# Altium schematic sheet esquematico.SchDoc
size A4
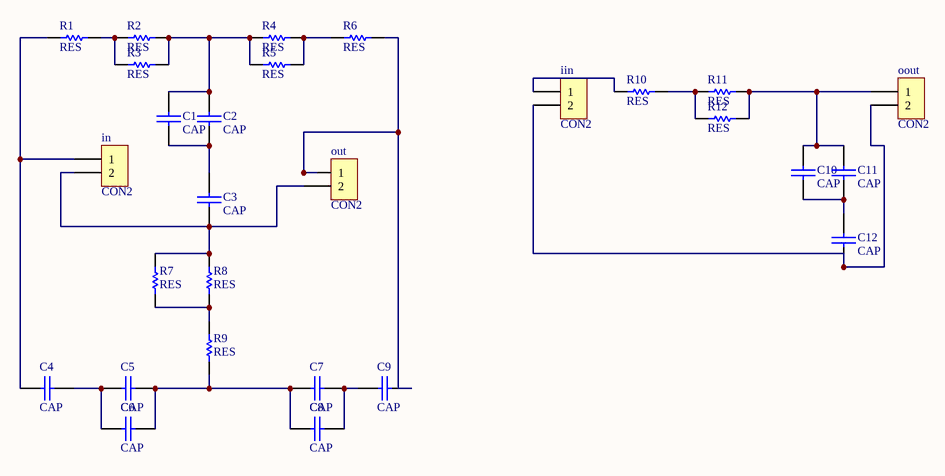
[diagram p0: esquematico.SchDoc]

## Parts
C1  CAP  [CAP200]
C2  CAP  [CAP200]
C3  CAP  [CAP200]
C4  CAP  [CAP200]
C5  CAP  [CAP200]
C6  CAP  [CAP200]
C7  CAP  [CAP200]
C8  CAP  [CAP200]
C9  CAP  [CAP200]
C10  CAP  [CAP200]
C11  CAP  [CAP200]
C12  CAP  [CAP200]
iin  CON2  [SIP2]
in  CON2  [SIP2]
oout  CON2  [SIP2]
out  CON2  [SIP2]
R1  RES  [RES400]
R2  RES  [RES400]
R3  RES  [RES400]
R4  RES  [RES400]
R5  RES  [RES400]
R6  RES  [RES400]
R7  RES  [RES400]
R8  RES  [RES400]
R9  RES  [RES400]
R10  RES  [RES400]
R11  RES  [RES400]
R12  RES  [RES400]

## Nets
NetC1_1: C1.1 C2.1 R2.2 R3.2 R4.1 R5.1
NetC1_2: C1.2 C2.2 C3.1
NetC3_2: C3.2 in.2 out.2 R7.2 R8.2
NetC4_1: C4.1 in.1 R1.1
NetC4_2: C4.2 C5.1 C6.1
NetC5_2: C5.2 C6.2 C7.2 C8.1 R9.1
NetC7_1: C7.1 C8.2 C9.1
NetC9_2: C9.2 out.1 R6.2
NetC10_1: C10.1 C11.1 oout.1 R11.2 R12.2
NetC10_2: C10.2 C11.2 C12.1
NetC12_2: C12.2 iin.2 oout.2
Netiin_1: iin.1 R10.1
NetR1_2: R1.2 R2.1 R3.1
NetR4_2: R4.2 R5.2 R6.1
NetR7_1: R7.1 R8.1 R9.2
NetR10_2: R10.2 R11.1 R12.1